# Altium project LM_HTR_001_TEST.PrjPcb
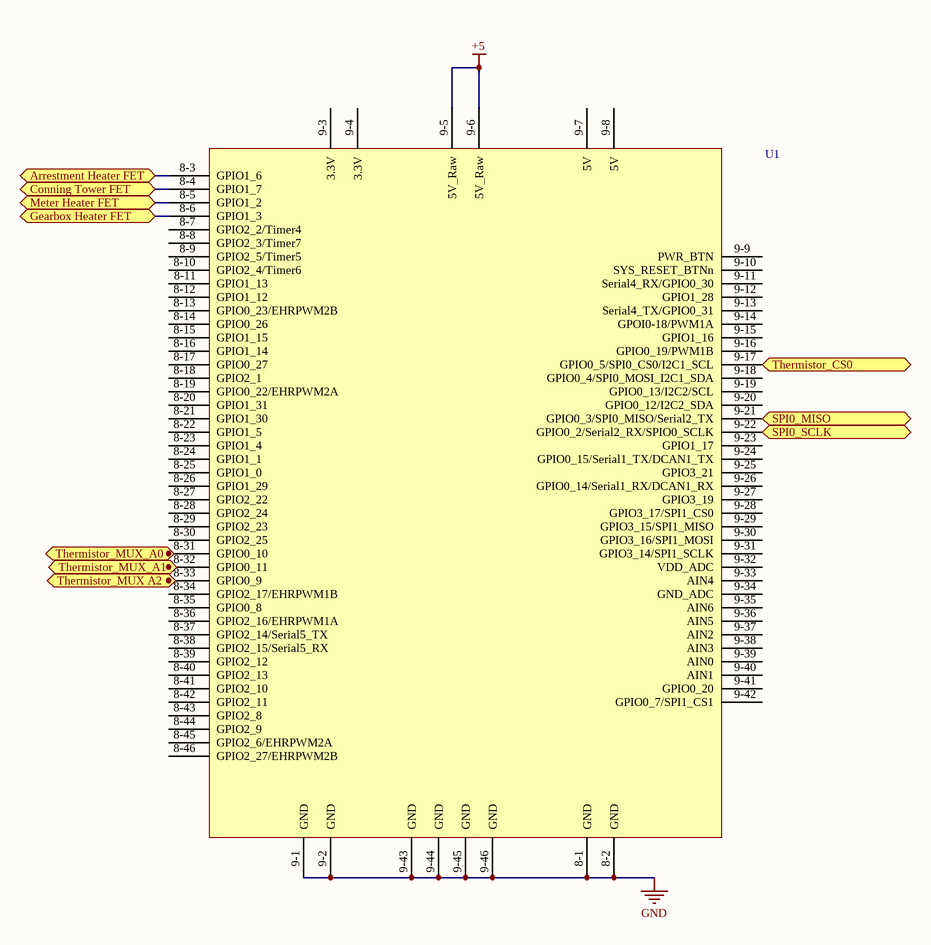
[diagram p0: LM_HTR_001_TEST.SchDoc]
2 sheets, 3 parts. Net scope: flat (ports and power ports of the same name join across sheets).
Board file: LM_HTR_001_TEST.PcbDoc
Sheets:
  LM_HTR_001_TEST.SchDoc
  Connectors.SchDoc

## Sheet LM_HTR_001_TEST.SchDoc: Heater Test Board
size OrCAD A; DocumentNumber: LM-HTR-001-TEST; Revision: A; SheetNumber: 1; SheetTotal: 2

### Parts
U1  BBB  [Beaglebone Black]  (value not drawn)

### Ports
Arrestment Heater FET, Conning Tower FET, Gearbox Heater FET, Meter Heater FET, SPI0_MISO, SPI0_SCLK, Thermistor_CS0, Thermistor_MUX A2, Thermistor_MUX_A0, Thermistor_MUX_A1

### Nets
+5: U1.9-5(5V_Raw) U1.9-6(5V_Raw)
GND: U1.8-1(GND) U1.8-2(GND) U1.9-1(GND) U1.9-2(GND) U1.9-43(GND) U1.9-44(GND) U1.9-45(GND) U1.9-46(GND)
SPI0_MISO: U1.9-21(GPIO0_3/SPI0_MISO/Serial2_TX) ; port SPI0_MISO
SPI0_SCLK: U1.9-22(GPIO0_2/Serial2_RX/SPIO0_SCLK) ; port SPI0_SCLK
Thermistor_CS0: U1.9-17(GPIO0_5/SPI0_CS0/I2C1_SCL) ; port Thermistor_CS0
NetP1_13: U1.8-5(GPIO1_2) ; port Meter Heater FET
NetP1_14: U1.8-4(GPIO1_7) ; port Conning Tower FET
NetP1_15: U1.8-6(GPIO1_3) ; port Gearbox Heater FET
NetP1_16: U1.8-3(GPIO1_6) ; port Arrestment Heater FET

Not connected (* = marked no-connect by the designer): U1 8-7(GPIO2_2/Timer4) 8-8(GPIO2_3/Timer7) 8-9(GPIO2_5/Timer5) 8-10(GPIO2_4/Timer6) 8-11(GPIO1_13) 8-12(GPIO1_12) 8-13(GPIO0_23/EHRPWM2B) 8-14(GPIO0_26) 8-15(GPIO1_15) 8-16(GPIO1_14) 8-17(GPIO0_27) 8-18(GPIO2_1) 8-19(GPIO0_22/EHRPWM2A) 8-20(GPIO1_31) 8-21(GPIO1_30) 8-22(GPIO1_5) 8-23(GPIO1_4) 8-24(GPIO1_1) 8-25(GPIO1_0) 8-26(GPIO1_29) 8-27(GPIO2_22) 8-28(GPIO2_24) 8-29(GPIO2_23) 8-30(GPIO2_25) 8-31(GPIO0_10) 8-32(GPIO0_11) 8-33(GPIO0_9) 8-34(GPIO2_17/EHRPWM1B) 8-35(GPIO0_8) 8-36(GPIO2_16/EHRPWM1A) 8-37(GPIO2_14/Serial5_TX) 8-38(GPIO2_15/Serial5_RX) 8-39(GPIO2_12) 8-40(GPIO2_13) 8-41(GPIO2_10) 8-42(GPIO2_11) 8-43(GPIO2_8) 8-44(GPIO2_9) 8-45(GPIO2_6/EHRPWM2A) 8-46(GPIO2_27/EHRPWM2B) 9-3(3.3V) 9-4(3.3V) 9-7(5V) 9-8(5V) 9-9(PWR_BTN) 9-10(SYS_RESET_BTNn) 9-11(Serial4_RX/GPIO0_30) 9-12(GPIO1_28) 9-13(Serial4_TX/GPIO0_31) 9-14(GPOI0-18/PWM1A) 9-15(GPIO1_16) 9-16(GPIO0_19/PWM1B) 9-18(GPIO0_4/SPI0_MOSI_I2C1_SDA) 9-19(GPIO0_13/I2C2/SCL) 9-20(GPIO0_12/I2C2_SDA) 9-23(GPIO1_17) 9-24(GPIO0_15/Serial1_TX/DCAN1_TX) 9-25(GPIO3_21) 9-26(GPIO0_14/Serial1_RX/DCAN1_RX) 9-27(GPIO3_19) 9-28(GPIO3_17/SPI1_CS0) 9-29(GPIO3_15/SPI1_MISO) 9-30(GPIO3_16/SPI1_MOSI) 9-31(GPIO3_14/SPI1_SCLK) 9-32(VDD_ADC) 9-33(AIN4) 9-34(GND_ADC) 9-35(AIN6) 9-36(AIN5) 9-37(AIN2) 9-38(AIN3) 9-39(AIN0) 9-40(AIN1) 9-41(GPIO0_20) 9-42(GPIO0_7/SPI1_CS1)

### Notes on the sheet
- Title
- Size:
- Date:
- Orcad A
- Number:
- Time:
- Revision:
- Sheet
- of
- ZLS Corporation
- 7801 North Lamar Blvd.
- Suite E-184
- Austin, Texas 78752  USA
- (512) 453-0288
- File:

### Library data of the parts
U1 = Beaglebone_Black: Beaglebone Black

## Sheet Connectors.SchDoc
size OrCAD A
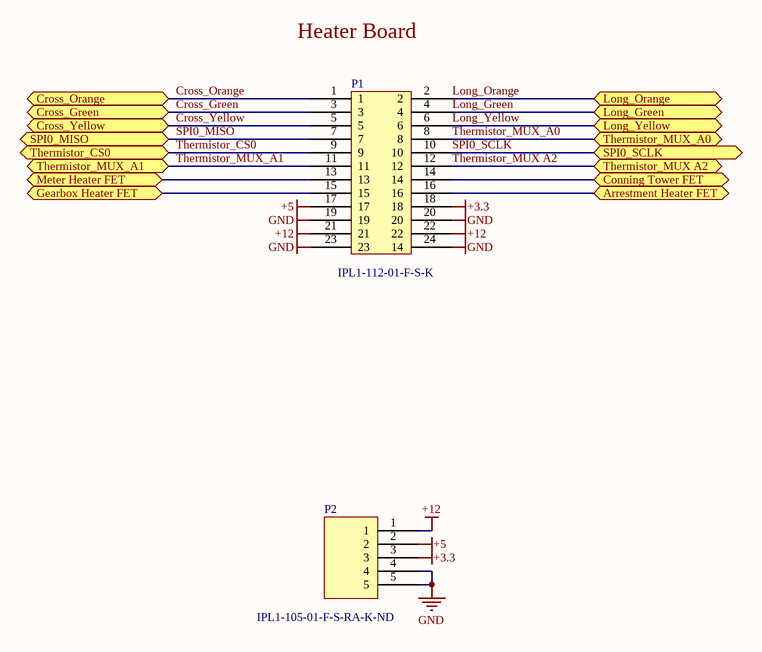
[diagram p1: Connectors.SchDoc]

### Parts
P1  IPL1-112-01-F-S-K  [IPL1-112-01-F-S-K]
P2  Supplier Part Number 1: IPL1-105-01-F-S-RA-K-ND  [IPL1-105-01-F-S-RA]  (hidden comment: IPL1-105-01-F-S-RA)

### Ports
Arrestment Heater FET, Conning Tower FET, Cross_Green, Cross_Orange, Cross_Yellow, Gearbox Heater FET, Long_Green, Long_Orange, Long_Yellow, Meter Heater FET, SPI0_MISO, SPI0_SCLK, Thermistor_CS0, Thermistor_MUX A2, Thermistor_MUX_A0, Thermistor_MUX_A1

### Nets
+3.3: P1.18 P2.3
+5: P1.17 P2.2
+12: P1.21 P1.22 P2.1
GND: P1.19 P1.20 P1.23 P1.24(14) P2.4 P2.5
Cross_Green: P1.3 ; port Cross_Green
Cross_Orange: P1.1 ; port Cross_Orange
Cross_Yellow: P1.5 ; port Cross_Yellow
Long_Green: P1.4 ; port Long_Green
Long_Orange: P1.2 ; port Long_Orange
Long_Yellow: P1.6 ; port Long_Yellow
SPI0_MISO: P1.7 ; port SPI0_MISO
SPI0_SCLK: P1.10 ; port SPI0_SCLK
Thermistor_CS0: P1.9 ; port Thermistor_CS0
Thermistor_MUX A2: P1.12 ; port Thermistor_MUX A2
Thermistor_MUX_A0: P1.8 ; port Thermistor_MUX_A0
Thermistor_MUX_A1: P1.11 ; port Thermistor_MUX_A1
NetP1_13: P1.13 ; port Meter Heater FET
NetP1_14: P1.14 ; port Conning Tower FET
NetP1_15: P1.15 ; port Gearbox Heater FET
NetP1_16: P1.16 ; port Arrestment Heater FET

### Notes on the sheet
- Heater Board
- Title
- Size:
- Date:
- Orcad A
- Number:
- Time:
- Revision:
- Sheet
- of
- ZLS Corporation
- 7801 North Lamar Blvd.
- Suite E-184
- Austin, Texas 78752  USA
- (512) 453-0288
- File:

### Library data of the parts
P1 = IPL1-112-01-F-S-K: IPL1-112-01-F-D-K; Manufacturer: Samtec; Number of Contacts: 12; Gender: Male; Pitch: 2.54mm; Supplier 1: Newark; Supplier Part Number 1: 08W3504; Supplier 2: Avnet; Supplier Part Number 2: IPL1-112-01-F-S-K; Manufacturer Part Number: IPL1-112-01-F-S-K; Stock 2: 0; Mount: Through Hole; Packaging: Bulk; Termination: Solder; Orientation: Straight; Radiation Hardening: No; ComponentLink1URL: https://datasheet.ciiva.com/9444/ipl1-9444389.pdf; ComponentLink1Description: https://datasheet.ciiva.com/9444/ipl1-9444389.pdf
P2 = IPL1-105-01-F-S-RA: Supplier 1: Digi-Key

## Nets that join several sheets
+5: LM_HTR_001_TEST (U1.9-5 U1.9-6), Connectors (P1.17 P2.2)
GND: LM_HTR_001_TEST (8 pins), Connectors (6 pins)
NetP1_13: LM_HTR_001_TEST (U1.8-5), Connectors (P1.13)
NetP1_14: LM_HTR_001_TEST (U1.8-4), Connectors (P1.14)
NetP1_15: LM_HTR_001_TEST (U1.8-6), Connectors (P1.15)
NetP1_16: LM_HTR_001_TEST (U1.8-3), Connectors (P1.16)
SPI0_MISO: LM_HTR_001_TEST (U1.9-21), Connectors (P1.7)
SPI0_SCLK: LM_HTR_001_TEST (U1.9-22), Connectors (P1.10)
Thermistor_CS0: LM_HTR_001_TEST (U1.9-17), Connectors (P1.9)